# Altium schematic sheet 原理图.SchDoc
size B
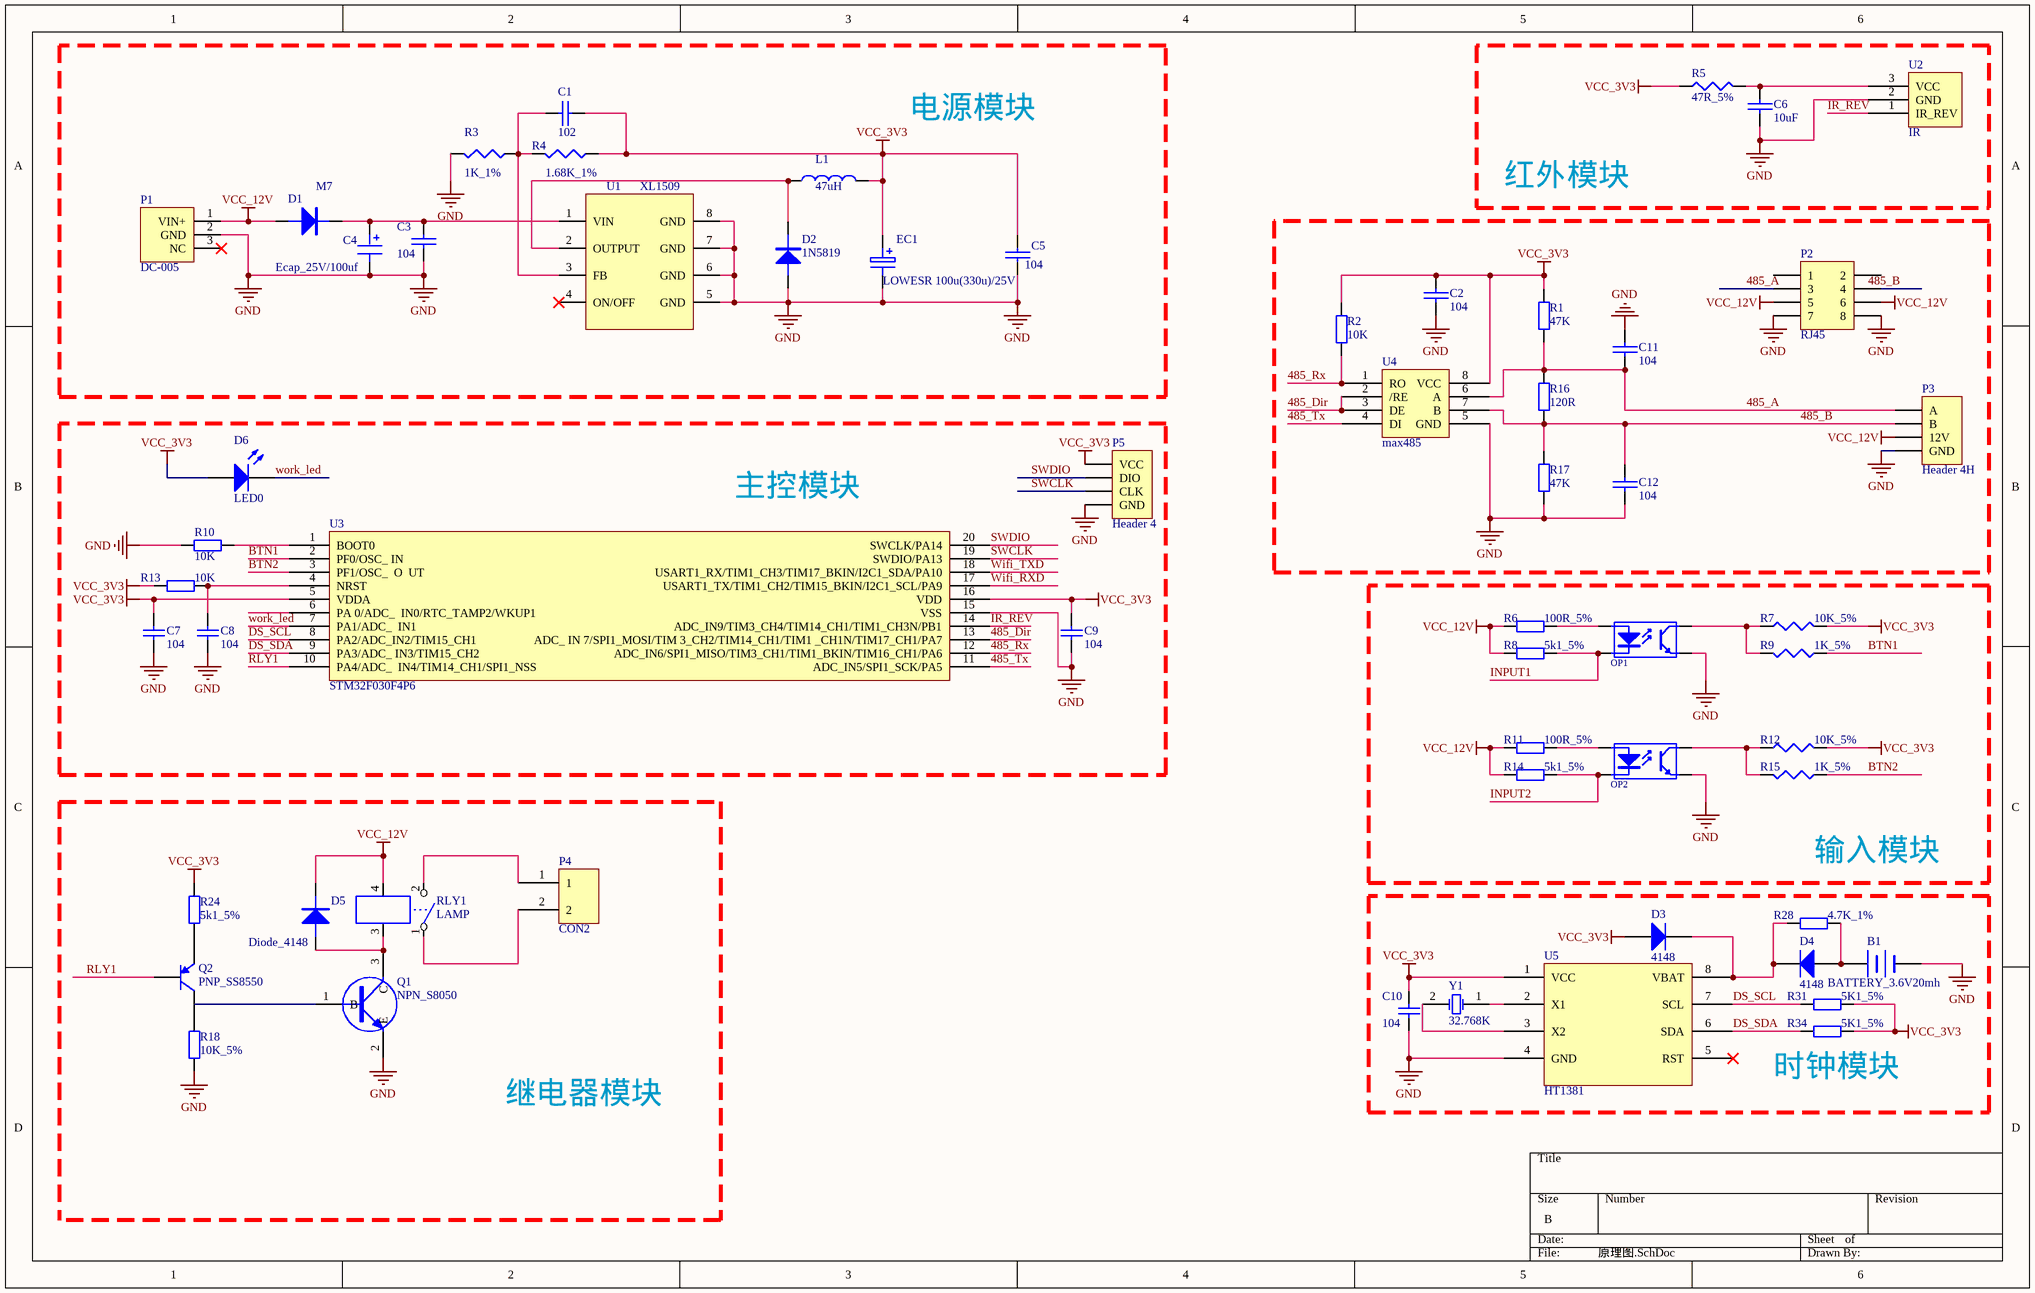
[diagram p0: 原理图.SchDoc]

## Parts
B1  BATTERY_3.6V20mh  [NI-MH_20mA+C]
C1  102  [0603_CAP_SMT]
C2  104  [0603_CAP_SMT]
C3  104  [0603_CAP_SMT]
C4  Ecap_25V/100uf  [SMT_CAP6.3]
C5  104  [0603_CAP_SMT]
C6  10uF  [0805_CAP]
C7  104  [C0402]
C8  104  [C0402]
C9  104  [C0402]
C10  104  [0603_C]
C11  104  [0603_CAP_SMT]
C12  104  [0603_CAP_SMT]
D1  M7  [IN5819]
D2  1N5819  [SMD]
D3  4148  [SMAF_S5]
D4  4148  [SMAF_S5]
D5  Diode_4148  [SMD]
D6  LED0  [LED-0]
EC1  LOWESR 100u(330u)/25V  [SMT_CAP6.3]
L1  47uH  [0630]
OP1  EL817  [E817-SMD]  (value not drawn)
OP2  EL817  [E817-SMD]  (value not drawn)
P1  DC-005  [DC-5.5-2.1mm]
P2  RJ45  [HDR2X4]
P3  Header 4H  [HDR1X4H]
P4  CON2  [HP2PA-5.08]
P5  Header 4  [HDR1X4]
Q1  NPN_S8050  [SOT-23_FR]
Q2  PNP_SS8550  [TO-92A]
R1  47K  [0603_RES_SMT]
R2  10K  [0603_RES_SMT]
R3  1K_1%  [0603_RES_SMT]
R4  1.68K_1%  [0603_RES_SMT]
R5  47R_5%  [0805_RES]
R6  100R_5%  [0805_Res]
R7  10K_5%  [0805_RES]
R8  5k1_5%  [0805_Res]
R9  1K_5%  [0805_RES]
R10  10K  [R0402]
R11  100R_5%  [0805_Res]
R12  10K_5%  [0805_RES]
R13  10K  [R0402]
R14  5k1_5%  [0805_Res]
R15  1K_5%  [0805_RES]
R16  120R  [0603_RES_SMT]
R17  47K  [0603_RES_SMT]
R18  10K_5%  [R0402]
R24  5k1_5%  [R0402]
R28  4.7K_1%  [0603_R]
R31  5K1_5%  [0603_R]
R34  5K1_5%  [0603_R]
RLY1  LAMP  [SANYOU_RLY112DM]
U1  XL1509  [SOP8]
U2  IR  [IR_REV_W3]
U3  STM32F030F4P6
U4  max485  [SOP8]
U5  HT1381  [SOP-8_150mil]
Y1  32.768K  [SMD-3215_2P FC - 135]

## Blocks framed on the sheet
电源模块: C1 C3-C5 D1 D2 EC1 L1 P1 R3 R4 U1
红外模块: C6 R5 U2
主控模块: C7-C9 D6 P5 R10 R13 U3
输入模块: OP1 OP2 R6-R9 R11 R12 R14 R15
继电器模块: D5 P4 Q1 Q2 R18 R24 RLY1
时钟模块: B1 C10 D3 D4 R28 R31 R34 U5 Y1

## Nets
GND: B1.2(-) C2.1 C3.2 C4.2 C5.2 C6.2 C7.1 C8.1 C9.1 C10.1 C11.2 C12.1 D2.A EC1.2 OP1.3(E) OP2.3(E) P1.2(GND) P2.7 P2.8 P3.4(GND) P5.4(GND) Q1.2(E) R3.2 R10.1 R17.1 R18.1 U1.5(GND) U1.6(GND) U1.7(GND) U1.8(GND) U2.2(GND) U3.15(VSS) U4.5(GND) U5.4(GND)
VCC_3V3: C1.2 C2.2 C5.1 C7.2 C9.2 C10.2 D3.1(A) D6.1(A) EC1.1 L1.2 P5.1(VCC) R1.2 R2.2 R4.1 R5.1 R7.2 R12.2 R13.1 R24.2 R31.1 R34.2 U3.5(VDDA) U3.16(VDD) U4.8(VCC) U5.1(VCC)
VCC_12V: D1.A D5.K P1.1(VIN+) P2.5 P2.6 P3.3(12V) R6.2 R8.2 R11.2 R14.2 RLY1.4
485_A: C11.1 P2.3 P3.1(A) R1.1 R16.2 U4.6(A)
485_B: C12.2 P3.2(B) R16.1 R17.2 U4.7(B)
485_Dir: U3.13(ADC__IN_7/SPI1_MOSI/TIM_3_CH2/TIM14_CH1/TIM1__CH1N/TIM17_CH1/PA7) U4.2(/RE) U4.3(DE)
485_Rx: R2.1 U3.12(ADC_IN6/SPI1_MISO/TIM3_CH1/TIM1_BKIN/TIM16_CH1/PA6) U4.1(RO)
485_Tx: U3.11(ADC_IN5/SPI1_SCK/PA5) U4.4(DI)
BTN1: R9.1 U3.2(PF0/OSC__IN)
BTN2: R15.1 U3.3(PF1/OSC___O__UT)
DS_SCL: R31.2 U3.8(PA2/ADC_IN2/TIM15_CH1) U5.7(SCL)
DS_SDA: R34.1 U3.9(PA3/ADC__IN3/TIM15_CH2) U5.6(SDA)
INPUT1: OP1.2(K) R8.1
INPUT2: OP2.2(K) R14.1
IR_REV: U2.1(IR_REV) U3.14(ADC_IN9/TIM3_CH4/TIM14_CH1/TIM1_CH3N/PB1)
RLY1: Q2.2(B) U3.10(PA4/ADC___IN4/TIM14_CH1/SPI1_NSS)
SWCLK: P5.3(CLK) U3.19(SWDIO/PA13)
SWDIO: P5.2(DIO) U3.20(SWCLK/PA14)
Wifi_RXD: U3.17(USART1_TX/TIM1_CH2/TIM15_BKIN/I2C1_SCL/PA9)
Wifi_TXD: U3.18(USART1_RX/TIM1_CH3/TIM17_BKIN/I2C1_SDA/PA10)
work_led: D6.2(K) U3.7(PA1/ADC___IN1)
NetB1_1: B1.1(+) D4.1(A) R28.1
NetC1_1: C1.1 R3.1 R4.2 U1.3(FB)
NetC3_1: C3.1 C4.1 D1.K U1.1(VIN)
NetC6_1: C6.1 R5.2 U2.3(VCC)
NetC8_2: C8.2 R13.2 U3.4(NRST)
NetD2_K: D2.K L1.1 U1.2(OUTPUT)
NetD3_2: D3.2(K) D4.2(K) R28.2 U5.8(VBAT)
NetD5_A: D5.A Q1.3(C) RLY1.3
NetOP1_1: OP1.1(A) R6.1
NetOP1_4: OP1.4(C) R7.1 R9.2
NetOP2_1: OP2.1(A) R11.1
NetOP2_4: OP2.4(C) R12.1 R15.2
NetP4_1: P4.1 RLY1.2
NetP4_2: P4.2 RLY1.1
NetQ2_1: Q2.1(E) R24.1
NetQ2_3: Q2.3(C) R18.2
NetR10_2: R10.2 U3.1(BOOT0)
NetU5_2: U5.2(X1) Y1.1(OSC1)
NetU5_3: U5.3(X2) Y1.2(OSC2)

Not connected (* = marked no-connect by the designer): P1 3(NC)*; P2 1 2 4; Q1 1(B); U1 4(ON/OFF)*; U3 6(PA_0/ADC___IN0/RTC_TAMP2/WKUP1); U5 5(RST)*

## Notes on the sheet
- Labels drawn without touching a wire or pin: 485_B

## Library data of the parts
B1 = BATTERY_3.6V20mh: https://item.taobao.com/item.htm?spm=a1z10.5-c.w4002-471439023.33.YIdXb6&id=524181772992; Price(RMB): 1.3
C1-C3 C5 C6 C11 C12 = CAP
C4 = Ecap_25V/100uf: https://item.taobao.com/item.htm?spm=a1z10.5-c.w4002-11020631983.33.qoX6of&id=7423722992; Price(RMB): 0.04
C7-C9 = Cap: Capacitor; Value: 100pF; Published: 8-Jun-2000; LatestRevisionDate: 17-Jul-2002; LatestRevisionNote: Re-released for DXP Platform.; PackageReference: RAD-0.3; Publisher: Altium Limited
C10 = Cap_%10: https://item.taobao.com/item.htm?spm=a1z09.2.0.0.hNveX1&id=9716419590&_u=7ok62qs2673; Price(RMB): 0.03
D1 D2 = DIODE
D3 D4 = Diode 1N914: High Conductance Fast Diode; Published: 8-Jun-2000; LatestRevisionDate: 17-Jul-2002; LatestRevisionNote: Re-released for DXP Platform.; DatasheetVersion: 1997; PackageReference: DO-35; Publisher: Altium Limited; PackageDescription: Diode, Axial; Body 3.8 x 1.9 mm (LxDia. max), Lead Dia. 0.53 mm (max); Code_JEDEC: DO-204-AH; ComponentLink1Description: Manufacturer Link; ComponentLink1URL: http://www.fairchildsemi.com/; ComponentLink2Description: Datasheet; ComponentLink2URL: http://www.fairchildsemi.com/ds/1N%2F1N4448.pdf
D5 = Diode_SS14: https://item.taobao.com/item.htm?spm=a1z10.3-c.w4002-11020657456.14.qD67rq&id=6126767310; Price(RMB): 0.04
D6 = LED0: Typical INFRARED GaAs LED; Published: 8-Jun-2000; LatestRevisionDate: 08-Jul-2005; LatestRevisionNote: Mech Layer 1 removed.; PackageReference: LED-0; Publisher: Altium Limited; PackageDescription: LED; 2 Leads
EC1 = ELECTRO1
L1 = INDUCTOR1
OP1 OP2 = EL817: https://item.taobao.com/item.htm?spm=a1z10.3-c.w4002-11020657456.9.xiQJya&id=9840822052; Price(RMB): 0.17
P1 = DC-005: https://item.taobao.com/item.htm?spm=a1z10.3-c.w4002-11020657456.12.3OzBHB&id=5709638982; Price(RMB): 0.07
P2 = Header 4X2: Header, 4-Pin, Dual row; LatestRevisionDate: 17-Jul-2002; LatestRevisionNote: Re-released for DXP Platform.; Publisher: Altium Limited
P3 = Header 4H: Header, 4-Pin, Right Angle; LatestRevisionDate: 17-Jul-2002; LatestRevisionNote: Re-released for DXP Platform.; Publisher: Altium Limited
P5 = Header 4: Header, 4-Pin; LatestRevisionDate: 17-Jul-2002; LatestRevisionNote: Re-released for DXP Platform.; Publisher: Altium Limited
Q1 = NPN_S8050: https://item.taobao.com/item.htm?spm=a1z10.3-c.w4002-11020657456.15.ysrU5Y&id=5957247576; Price(RMB): 0.03
Q2 = 2N3906: PNP General Purpose Amplifier; Published: 8-Jun-2000; LatestRevisionDate: 15-Jan-2003; LatestRevisionNote: PCB Footprint 'BCY-W3/D4.7' replaced; DatasheetVersion: 1997; PackageVersion: Sep-1998; PackageReference: TO-92A; Publisher: Altium Limited; PackageDescription: TO, Flat Index; 3 In-Line, Axial Leads; Body Dia. 4.5mm; Leads 0.51 x 0.48 mm (max); ComponentLink1Description: Manufacturer Link; ComponentLink1URL: http://www.fairchildsemi.com/; ComponentLink2Description: Datasheet; ComponentLink2URL: http://www.fairchildsemi.com/ds/2N%2F2N3906.pdf
R1 R2 R16 R17 = Res_%5: https://item.taobao.com/item.htm?spm=a1z10.3-c.w4002-11020657456.13.233szV&id=14686636311; Price(RMB): 0.01
R3-R5 R7 R9 R12 R15 = RES
R6 R8 R11 R14 R28 R31 R34 = Res_5%: https://item.taobao.com/item.htm?spm=a1z10.3-c.w4002-11020657456.13.233szV&id=14686636311; Price(RMB): 0.01
R10 R13 R18 R24 = Res2: Resistor; Value: 1K; Published: 8-Jun-2000; LatestRevisionDate: 17-Jul-2002; LatestRevisionNote: Re-released for DXP Platform.; PackageReference: AXIAL-0.4; Publisher: Altium Limited
RLY1 = RELAY-SPST
U2 = IR_REV: 红外接收管
U5 = DS1302
Y1 = XTAL: Crystal Oscillator